# EasyEDA Pro project OV-Watch_V2.4_LCProject_2024-05-25.epro, schematic core
Create Date: 2023-07-01; Page Name: P1; Project Name: OV-Watch_V2.4; Schematic Name: Core; Update Date: 2024-04-28; Company: 嘉立创EDA; Page Size: A3; Version: V1.0
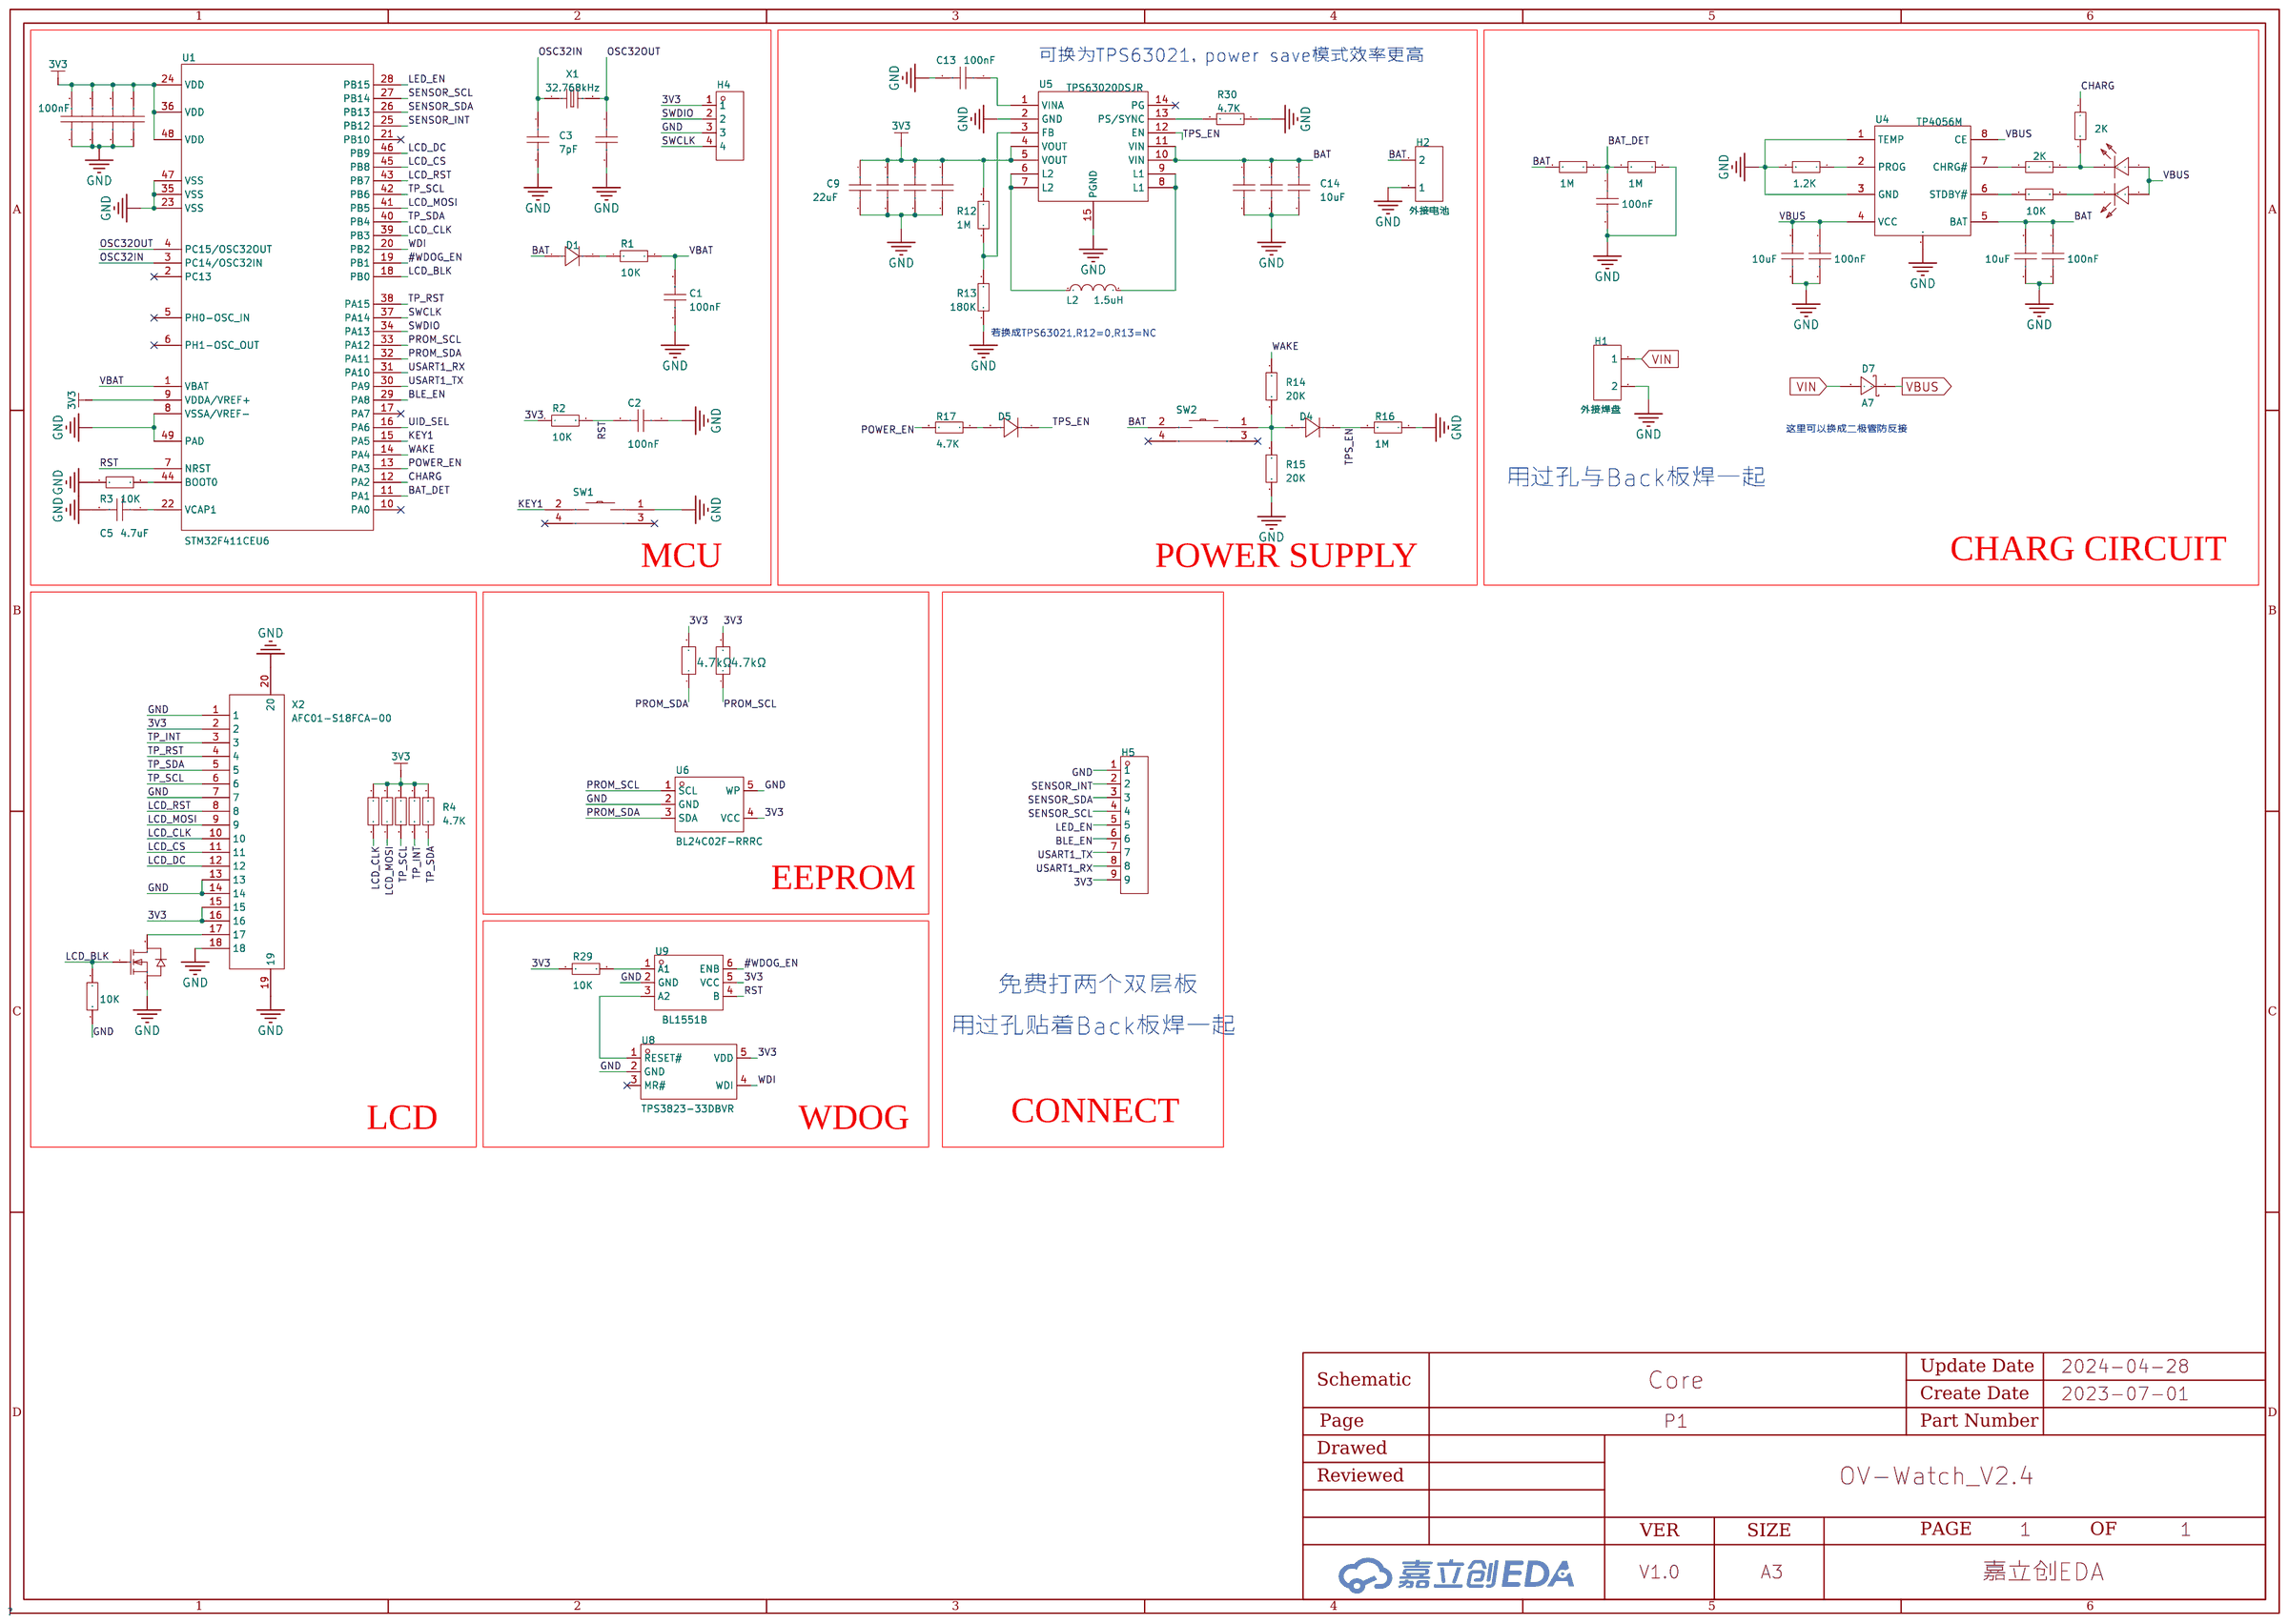
[diagram p3: schematic sheet]

## Parts
C1  100nF  [C0402]
C2  100nF  [C0402]
C3  7pF  [C0402]
C4  7pF  [C0402]
C5  4.7uF  [C0402]
C9  22uF  [C0402]
C10  22uF  [C0402]
C11  22uF  [C0402]
C12  22uF  [C0402]
C13  100nF  [C0402]
C14  10uF  [C0402]
C15  10uF  [C0402]
C16  10uF  [C0402]
C17  10uF  [C0402]
C18  100nF  [C0402]
C19  10uF  [C0402]
C20  100nF  [C0402]
C21  100nF  [C0402]
C22  100nF  [C0402]
C23  100nF  [C0402]
C24  100nF  [C0402]
C25  100nF  [C0402]
D1  1N4007  [SOD-123FL_L2.8-W1.8-LS3.7-RD]
D4  1N4007  [SOD-123FL_L2.8-W1.8-LS3.7-RD]
D5  1N4007  [SOD-123FL_L2.8-W1.8-LS3.7-RD]
D7  A7  [SOD-123FL_L2.8-W1.8-LS3.7-RD]
H1  外接焊盘  [HDR-TH_2P-P2.54-V-M-1]
H2  外接电池  [HDR-TH_2P-P2.54-V-M-1]
H4  1125-1104G0S116C001  [HDR-TH_4P-P2.54-V-M-1]
H5  DZ254R-11-09-63  [HDR-TH_9P-P2.54-V-M]
L2  1.5uH  [IND-SMD_L4.0-W4.0_SWPA4018S]
LED1  SZYY0805R  [LED0805-R-RD]
LED2  NCD0805G1  [LED0805-R-RD]
R1  10K  [R0402]
R2  10K  [R0402]
R3  10K  [R0402]
R4  4.7K  [R0402]
R5  4.7K  [R0402]
R6  4.7K  [R0402]
R7  4.7K  [R0402]
R8  4.7K  [R0402]
R12  1M  [R0402]
R13  180K  [R0402]
R14  20K  [R0402]
R15  20K  [R0402]
R16  1M  [R0402]
R17  4.7K  [R0402]
R18  2K  [R0402]
R19  10K  [R0402]
R20  2K  [R0402]
R22  1.2K  [R0402]
R23  1M  [R0402]
R24  1M  [R0402]
R25  10K  [R0402]
R27  4.7kΩ  [R0402]
R28  4.7kΩ  [R0402]
R29  10K  [R0402]
R30  4.7K  [R0402]
SW1  -  [KEY-SMD_K2-1806SA-C3DW-04]
SW2  -  [KEY-SMD_K2-1806SA-C3DW-04]
U1  STM32F411CEU6  [UFQFPN-48_L7.0-W7.0-P0.50-BL-EP]
U2  2N7002  [SOT-23-3_L2.9-W1.3-P1.90-LS2.4-BR]
U4  TP4056M  [MSOP-8_L3.0-W3.0-P0.65-LS5.0-BL-EP]
U5  TPS63020DSJR  [VSON-14_L4.0-W3.0-P0.50-BL-EP_TI_DSJ]
U6  BL24C02F-RRRC  [TSOT-23-5_L2.9-W1.6-P0.95-LS2.8-BL]
U8  TPS3823-33DBVR  [SOT-23-5_L3.0-W1.7-P0.95-LS2.8-BR]
U9  BL1551B  [SC-70-6_L2.1-W1.3-P0.65-LS2.3-BR]
X1  -  [OSC-SMD_L3.2-W1.5]
X2  AFC01-S18FCA-00  [FPC-SMD_18P-P0.50_JS_AFC01-S18FCA-00]

## Library data of the parts
C1-C5 C9-C25 = CAP_0402: Supplier Footprint: 0402
D1 D4 D5 = 1N4007_C2892681: 二极管配置:-;直流反向耐压(Vr):1kV;平均整流电流(Io):900mA;正向压降(Vf):1.1V@1A;反向电流(Ir):10A@1kV;; LCSC Part Name: 1kV900mA1.1V@1ASOD-123FL; Supplier Part: C2892681; Manufacturer: YONGYUTAI(永裕泰); Supplier Footprint: SOD-123FL; JLCPCB Part Class: ExtendedPart; Datasheet: https://atta.szlcsc.com/upload/public/pdf/source/20210906/CD4B8BA5932635E7169B31B2BD14088A.pdf; Supplier: LCSC; Reverse Voltage (Vr): 1kV; Average Rectified Current (Io): 900mA; Forward Voltage (Vf@If): 1.1V@1A; Reverse Leakage Current: 10A@1kV
D7 = A7_C2891324: 二极管配置:独立式;直流反向耐压(Vr):1kV;平均整流电流(Io):1A;正向压降(Vf):1.1V@1A;反向电流(Ir):5μA@1kV;; LCSC Part Name: 1kV 1A 1.1V@1A; Supplier Part: C2891324; Manufacturer: GOODWORK(固得沃克); Supplier Footprint: SOD123FL; JLCPCB Part Class: Extended Part; Datasheet: https://atta.szlcsc.com/upload/public/pdf/source/20210903/C6D4BE94189732442E7E9701A5BFE16D.pdf; Supplier: LCSC; Diode Configuration: 独立式; Reverse Voltage (Vr): 1kV; Average Rectified Current (Io): 1A; Forward Voltage (Vf@If): 1.1V@1A; Reverse Leakage Current: 5μA@1kV
H1 H2 = 826629-2: 间距:2.54mm;总PIN位数:2;排数:1;插针结构:1x2P;行距:-;安装类型:直插;圆针/方针:-;额定电流:-;额定电压:-;配合针长度:-;塑高:2.8mm;触头材质:黄铜;触头镀层:-;颜色:绿色;; LCSC Part Name: 2.54mm1x2P直插分离式金; Supplier Part: C86471; Manufacturer: TEConnectivity(美国泰科); Supplier Footprint: 插件,P=2.54mm; JLCPCB Part Class: ExtendedPart; Datasheet: https://atta.szlcsc.com/upload/public/pdf/source/20161105/1478330325829.pdf; Supplier: LCSC; Pitch: 2.54mm; Number of Pins: 2; Number of Rows: 1; Pin Structure: 1x2P; Mounting Type: 直插; Insulation Height: 2.8mm; Contact Material: 黄铜; Color: 绿色
H4 = 1125-1104G0S116C001: 间距:2.54mm;总PIN位数:4;排数:1;插针结构:1x4P;行距:2.54mm;安装类型:直插;圆针/方针:方针;额定电流:3A;额定电压:320V;配合针长度:6.1mm;塑高:2.5mm;端接针长度:3mm;触头材质:黄铜;触头镀层:金;工作温度范围:-40~+105;颜色:黑色;; LCSC Part Name: 2.54mm1x4P直插方针; Supplier Part: C920779; Manufacturer: Wcon(维峰电子); Supplier Footprint: 插件,P=2.54mm; JLCPCB Part Class: ExtendedPart; Datasheet: https://atta.szlcsc.com/upload/public/pdf/source/20210514/C920781_63E6ED3EFA6284A9B57E07350A5F58E4.pdf; Supplier: LCSC; Pitch: 2.54mm; Number of Pins: 4; Number of Rows: 1; Pin Structure: 1x4P; Row Spacing: 2.54mm; Mounting Type: 直插; Circluar Pins/Square Pins: 方针; Current Rating (Max): 3A; Voltage Rating (Max): 320V; Length of Mating Pin: 6.1mm; Insulation Height: 2.5mm; Length of End Connection Pin: 3mm; Contact Material: 黄铜; Contact Plating: 金; Operating Temperature Range: -40~+105; Color: 黑色
H5 = DZ254R-11-09-63: 排数:单排;总PIN位数:9;间距:2.54mm;插针结构:1x9P;行距:-;安装类型:直插;圆针/方针:方针;额定电流:3A;额定电压:-;配合针长度:6mm;塑高:2.54mm;端接针长度:3mm;工作温度范围:-;颜色:-;; LCSC Part Name: 2.54mm1x9P直插方针; Supplier Part: C2935915; Manufacturer: DEALON(德艺隆); Supplier Footprint: 插件,P=2.54mm; JLCPCB Part Class: ExtendedPart; Datasheet: https://atta.szlcsc.com/upload/public/pdf/source/20211231/575FA3133C71038A037ABECAE7869EE6.pdf; Supplier: LCSC; Number of Rows: 单排; Number of Pins: 9; Pitch: 2.54mm; Pin Structure: 1x9P; Mounting Type: 直插; Circluar Pins/Square Pins: 方针; Current Rating (Max): 3A; Length of Mating Pin: 6mm; Insulation Height: 2.54mm; Length of End Connection Pin: 3mm
L2 = CKCS4018-1.5uH/N: 电感值:1.5uH;精度:±30%;额定电流:1.8A;直流电阻(DCR):30mΩ;; LCSC Part Name: 1.5uH±30%1.8A30mΩ; Supplier Part: C354573; Manufacturer: CENKER(岑科); Supplier Footprint: SMD; JLCPCB Part Class: 扩展库; Datasheet: https://atta.szlcsc.com/upload/public/pdf/source/20221012/49F45641DC809BF418836322376BC5FA.pdf; Supplier: LCSC; Tolerance: ±30%; Rated Current: 1.8A; DC Resistance (DCR): 30mΩ
LED1 = SZYY0805R: 发光颜色:红灯;二极管配置:-;透镜颜色:无色透明;主波长:615nm~630nm;峰值波长:645nm;色温:-;光通量(25时):-;测试电流:10mA;正向电压(VF):2.4V;发光强度:120mcd;功率:40mW;发光角度:120°;安装方式:-;工作温度:-40~+85;; LCSC Part Name: 红灯; Supplier Part: C434431; Manufacturer: yongyu(永裕光电); Supplier Footprint: 0805; JLCPCB Part Class: ExtendedPart; Datasheet: https://atta.szlcsc.com/upload/public/pdf/source/20191204/C434431_431C171B758FE4C37FA40B1B295AA7AB.pdf; Supplier: LCSC; Emitted Color: 红灯; Lens Color: 无色透明; Dominant Wavelength: 615nm~630nm; Peak Wavelength: 645nm; Forward Current: 10mA; Forward Voltage (VF): 2.4V; Luminous Intensity: 120mcd; Power Dissipation: 40mW; Viewing Angle: 120°; Operating Temperature: -40~+85
LED2 = NCD0805G1: 发光颜色:翠绿色;正向电压(VF):2.5V~3.6V;功率:72mW;正向电流:5mA;主波长:525nm~537.5nm;透镜颜色:无色透明透镜;发光强度:180mcd~400mcd;发光角度:130°;工作温度:-30℃~+85℃;; Supplier Part: C84260; Manufacturer: 国星光电; Supplier Footprint: 0805; JLCPCB Part Class: 扩展库; Datasheet: https://atta.szlcsc.com/upload/public/pdf/source/20200820/C84260_AFC7BF57C6FBA034D182BB8D10A67EFE.pdf; Supplier: LCSC; Emitted Color: 翠绿色; Forward Voltage (VF): 2.5V~3.6V; Power Dissipation: 72mW; Forward Current: 5mA; Dominant Wavelength: 525nm~537.5nm; Lens Color: 无色透明透镜; Luminous Intensity: 180mcd~400mcd; Viewing Angle: 130°; Operating Temperature: -30℃~+85℃
R1-R8 R12-R20 R22-R25 R29 R30 = Res_0402: Supplier Footprint: 0402
R27 R28 = 0402WGF4701TCE: 电阻类型:厚膜电阻;阻值:4.7kΩ;精度:±1%;功率:62.5mW;; LCSC Part Name: 4.7kΩ±1%62.5mW; Supplier Part: C25900; Manufacturer: UNI-ROYAL(厚声); Supplier Footprint: 0402; JLCPCB Part Class: BasicPart; Datasheet: https://atta.szlcsc.com/upload/public/pdf/source/20200306/C422600_1E6D84923E4A46A82E41ADD87F860B5C.pdf; Supplier: LCSC; Type: 厚膜电阻; Tolerance: ±1%; Power(Watts): 62.5mW; Temperature Coefficient: ±100ppm/℃; Overload Voltage (Max): 50V; Operating Temperature Range: -55℃~+155℃; link: https://item.szlcsc.com/323315.html; 3DModel: R0402_L1.0-W0.5-H0.5
SW1 SW2 = K2-1806SA-C3DW-04: 触点电流:50mA;额定电压(DC):12V;绝缘电阻:100MΩ;安装方式:卧贴;作用力:180gf@±30gf;机械寿命:100000;工作温度:-25~+85;开关长度:4.8mm;开关宽度:1.88mm;开关高度:4mm;; LCSC Part Name: 4.8x1.88x1.5小型侧按键180G; Supplier Part: C2690016; Manufacturer: 韩国韩荣; Supplier Footprint: SMD; JLCPCB Part Class: ExtendedPart; Datasheet: https://atta.szlcsc.com/upload/public/pdf/source/20201126/C961746_BE85072586CFEF659A466A854D742287.pdf; Supplier: LCSC; Contact Current: 50mA; Voltage Rating (DC): 12V; Insulation Resistance: 100MΩ; Mounting Style: 卧贴; Operating Force: 180gf@±30gf; Mechanical Life: 100000; Operating Temperature: -25~+85; Switch Length: 4.8mm; Switch Width: 1.88mm; Switch Height: 4mm
U1 = STM32F411CEU6: 主频（MAX):100MHz;工作电压:1.7V~3.6V;; Supplier Part: C60420; Manufacturer: ST(意法半导体); Supplier Footprint: UFQFPN-48; JLCPCB Part Class: ExtendedPart; Datasheet: https://atta.szlcsc.com/upload/public/pdf/source/20151026/1457707507170.pdf; Supplier: LCSC; Speed: 100MHz; Voltage - Supply (Vcc/Vdd): 1.7V~3.6V; Program Memory Size: 512KB; RAM Size: 128KB; Number of I/O: 36; A/D: 10x12bit; PWM: 32; UART/USART: 3USART; SPI: 5; I2C（SMBUS/PMBUS）: 3; USB Device: 1; USB Host/OTG: 1
U2 = 2N7002: 类型:-;漏源电压(Vdss):-;连续漏极电流(Id):-;功率(Pd):-;导通电阻(RDS(on)@Vgs,Id):-;阈值电压(Vgs(th)@Id):-;栅极电荷(Qg@Vgs):-;输入电容(Ciss@Vds):-;反向传输电容(Crss@Vds):-;; Supplier Part: C727149; Manufacturer: TWGMC(台湾迪嘉); Supplier Footprint: SOT-23; JLCPCB Part Class: ExtendedPart; Datasheet: https://atta.szlcsc.com/upload/public/pdf/source/20200827/C727149_F88DE2A79720D5B1ACE833184507B038.pdf; Supplier: LCSC
U4 = TP4056M: 充电电池的类型:-;电池单元组数:-;最大充电电流:-;充满的电池组电压:-;最大供应电压:-;; Supplier Part: C21417; Manufacturer: TOPPOWER(南京拓微); Supplier Footprint: MSOP-8PP; JLCPCB Part Class: 扩展库; Datasheet: https://atta.szlcsc.com/upload/public/pdf/source/20160713/1468379850451.pdf; Supplier: LCSC
U5 = TPS63020DSJR: 功能类型:升降压型;同步整流:是;输出通道数:1;拓扑结构:降压-升压式;输入电压:1.8V~5.5V;输出电压:1.2V~5.5V;输出电流(最大值):3.5A;开关频率:2.4MHz;; LCSC Part Name: 升降压型1.8V~5.5V3.5A2.4MHz; Supplier Part: C15483; Manufacturer: TI(德州仪器); Supplier Footprint: VSON-14_3x4x05P; JLCPCB Part Class: ExtendedPart; Datasheet: https://atta.szlcsc.com/upload/public/pdf/source/20140704/1457707124625.pdf; Supplier: LCSC; Function: 升降压型; Synchronous Rectification: 是; Number of Outputs: 1; Topology: 降压-升压式; Input Voltage: 1.8V~5.5V; Output Voltage: 1.2V~5.5V; Output Current (Max): 3.5A; Switching Frequency: 2.4MHz
U6 = BL24C02F-RRRC: 存储器类型:-;存储器容量:-;存储器接口类型:-;工作电压:-;; Supplier Part: C498263; Manufacturer: BL(上海贝岭); Supplier Footprint: TSOT-23-5L; JLCPCB Part Class: ExtendedPart; Datasheet: https://atta.szlcsc.com/upload/public/pdf/source/20200316/C498263_2740AC1866DA22EC4F69CE70EF24A621.pdf; Supplier: LCSC
U8 = TPS3823-33DBVR: TPS3823具有看门狗和手动复位功能的电压监控器（复位IC）; Supplier Part: C7719; Manufacturer: TI(德州仪器); Supplier Footprint: SOT-23-5; JLCPCB Part Class: ExtendedPart; Datasheet: https://atta.szlcsc.com/upload/public/pdf/source/20140704/1457707104303.pdf; Supplier: LCSC; Output Type: 推挽; Reset Active Level: 低电平有效; Number of Voltages Monitored: 1; Threshold Voltage: 2.93V; Input Voltage: -；-；-；-; Reset Timeout: 120ms; Operating Temperature: -40℃~+85℃@(TA); Type of the power management chip: 简单复位/加电复位
U9 = BL1551B: Supplier Part: C2944066; Manufacturer: BL(上海贝岭); Supplier Footprint: SC-70-6; JLCPCB Part Class: ExtendedPart; Datasheet: https://atta.szlcsc.com/upload/public/pdf/source/20220111/7C5AAA5FC97DA844C85990CC55D99B47.pdf; Supplier: LCSC
X1 = SC-32S32.768kHz20PPM7pF: 晶振类型:-;频率:-;频率公差:-;频率稳定度:-;负载电容:-;工作温度:-;; LCSC Part Name: 32.768kHz20PPM7pF; Supplier Part: C97604; Manufacturer: Seiko(精工); Supplier Footprint: SMD3215-2P; JLCPCB Part Class: 扩展库; Datasheet: https://atta.szlcsc.com/upload/public/pdf/source/20170329/1490752773868.pdf; Supplier: LCSC
X2 = AFC01-S18FCA-00: 间距:0.5mm;触点数量:18;锁定特性:翻盖式;安装类型:卧贴;触点类型:下接;工作温度范围:-;; LCSC Part Name: 0.5mmP数:18翻盖式下接; Supplier Part: C262666; Manufacturer: JS(钜硕电子); Supplier Footprint: SMD,P=0.5mm; JLCPCB Part Class: 扩展库; Datasheet: https://atta.szlcsc.com/upload/public/pdf/source/20190816/C413942_2A72D1AC756EAE17EEDF756A339D4500.pdf; Supplier: LCSC; Pitch: 0.5mm; Number of Contacts: 18; Locking Feature: 翻盖式; Mounting Type: 卧贴; Contact Type: 下接; Height Above Board: 2mm; FFC, FCB Thickness: 0.3mm

## Nets
3V3: C9.1 C10.1 C11.1 C12.1 C22.2 C23.2 C24.2 C25.2 H4.1 H5.9 R2.1 R4.2 R5.2 R6.2 R7.2 R8.2 R12.2 R27.2 R28.2 R29.1 U1.9(VDDA/VREF+) U1.24(VDD) U1.36(VDD) U1.48(VDD) U5.4(VOUT) U5.5(VOUT) U6.4(VCC) U8.5(VDD) U9.5(VCC) X2.2 X2.15 X2.16
GND: C1.1 C2.1 C3.2 C4.2 C5.2 C9.2 C10.2 C11.2 C12.2 C13.2 C14.2 C15.2 C16.2 C17.2 C18.2 C19.2 C20.2 C21.2 C22.1 C23.1 C24.1 C25.1 H1.2 H2.1 H4.3 H5.1 R3.1 R13.1 R15.1 R16.1 R22.2 R24.1 R25.1 R30.1 SW1.1 U1.8(VSSA/VREF-) U1.23(VSS) U1.35(VSS) U1.47(VSS) U1.49(PAD) U2.2(S) U4.1(TEMP) U4.3(GND) U4.9 U5.2(GND) U5.15(PGND) U6.2(GND) U6.5(WP) U8.2(GND) U9.2(GND) X2.1 X2.7 X2.13 X2.14 X2.18 X2.19 X2.20
VBAT: C1.2 R1.2 U1.1(VBAT)
VBUS: C17.1 C18.1 D7.1(K) LED1.1(+) LED2.1(A) U4.4(VCC) U4.8(CE)
VIN: D7.2(A) H1.1
#WDOG_EN: U1.19(PB1) U9.6(ENB)
BAT: C14.1 C15.1 C16.1 C19.1 C20.1 D1.2(A) H2.2 R23.2 SW2.2 U4.5(BAT) U5.10(VIN) U5.11(VIN)
BAT_DET: C21.1 R23.1 R24.2 U1.11(PA1)
BLE_EN: H5.6 U1.29(PA8)
CHARG: R20.1 U1.12(PA2)
KEY1: SW1.2 U1.15(PA5)
LCD_BLK: R25.2 U1.18(PB0) U2.1(G)
LCD_CLK: R8.1 U1.39(PB3) X2.10
LCD_CS: U1.45(PB8) X2.11
LCD_DC: U1.46(PB9) X2.12
LCD_MOSI: R7.1 U1.41(PB5) X2.9
LCD_RST: U1.43(PB7) X2.8
LED_EN: H5.5 U1.28(PB15)
OSC32IN: C3.1 U1.3(PC14/OSC32IN) X1.1
OSC32OUT: C4.1 U1.4(PC15/OSC32OUT) X1.2
POWER_EN: R17.2 U1.13(PA3)
PROM_SCL: R28.1 U1.33(PA12) U6.1(SCL)
PROM_SDA: R27.1 U1.32(PA11) U6.3(SDA)
RST: C2.2 R2.2 U1.7(NRST) U9.4(B)
SENSOR_INT: H5.2 U1.25(PB12)
SENSOR_SCL: H5.4 U1.27(PB14)
SENSOR_SDA: H5.3 U1.26(PB13)
SWCLK: H4.4 U1.37(PA14)
SWDIO: H4.2 U1.34(PA13)
TP_INT: R5.1 X2.3
TP_RST: U1.38(PA15) X2.4
TP_SCL: R6.1 U1.42(PB6) X2.6
TP_SDA: R4.1 U1.40(PB4) X2.5
TPS_EN: D4.1(K) D5.1(K) R16.2 U5.12(EN)
UID_SEL: U1.16(PA6)
USART1_RX: H5.8 U1.31(PA10)
USART1_TX: H5.7 U1.30(PA9)
WAKE: R14.2 U1.14(PA4)
WDI: U1.20(PB2) U8.4(WDI)
$1N9198: D1.1(K) R1.1
$1N10420: R3.2 U1.44(BOOT0)
$1N10586: C5.1 U1.22(VCAP1)
$1N12310: U2.3(D) X2.17
$1N19622: R12.1 R13.2 U5.3(FB)
$1N22333: L2.1 U5.6(L2) U5.7(L2)
$1N22702: L2.2 U5.8(L1) U5.9(L1)
$1N25828: D4.2(A) R14.1 R15.2 SW2.1
$1N34059: D5.2(A) R17.1
$1N35112: R19.2 U4.6(STDBY#)
$1N35199: R18.2 U4.7(CHRG#)
$1N35744: LED1.2(-) R18.1 R20.2
$1N36410: LED2.2(K) R19.1
$1N37898: R22.1 U4.2(PROG)
$1N149362: U8.1(RESET#) U9.3(A2)
$1N149393: R29.2 U9.1(A1)
$1N188625: R30.2 U5.13(PS/SYNC)
$1N188630: C13.1 U5.1(VINA)

Not connected (* = marked no-connect by the designer): SW1 3* 4*; SW2 3* 4*; U1 2(PC13)* 5(PH0-OSC_IN)* 6(PH1-OSC_OUT)* 10(PA0)* 17(PA7)* 21(PB10)*; U5 14(PG)*; U8 3(MR#)*

## Notes on the sheet
- 可换为TPS63021，power save模式效率更高
- 若换成TPS63021,R12=0,R13=NC
- 这里可以换成二极管防反接
- 用过孔与Back板焊一起
- MCU
- POWER SUPPLY
- CHARG CIRCUIT
- EEPROM
- 免费打两个双层板
- 用过孔贴着Back板焊一起
- CONNECT
- LCD
- WDOG
